# EAGLE schematic LSM9DS0 (EAGLE 7.1.0)
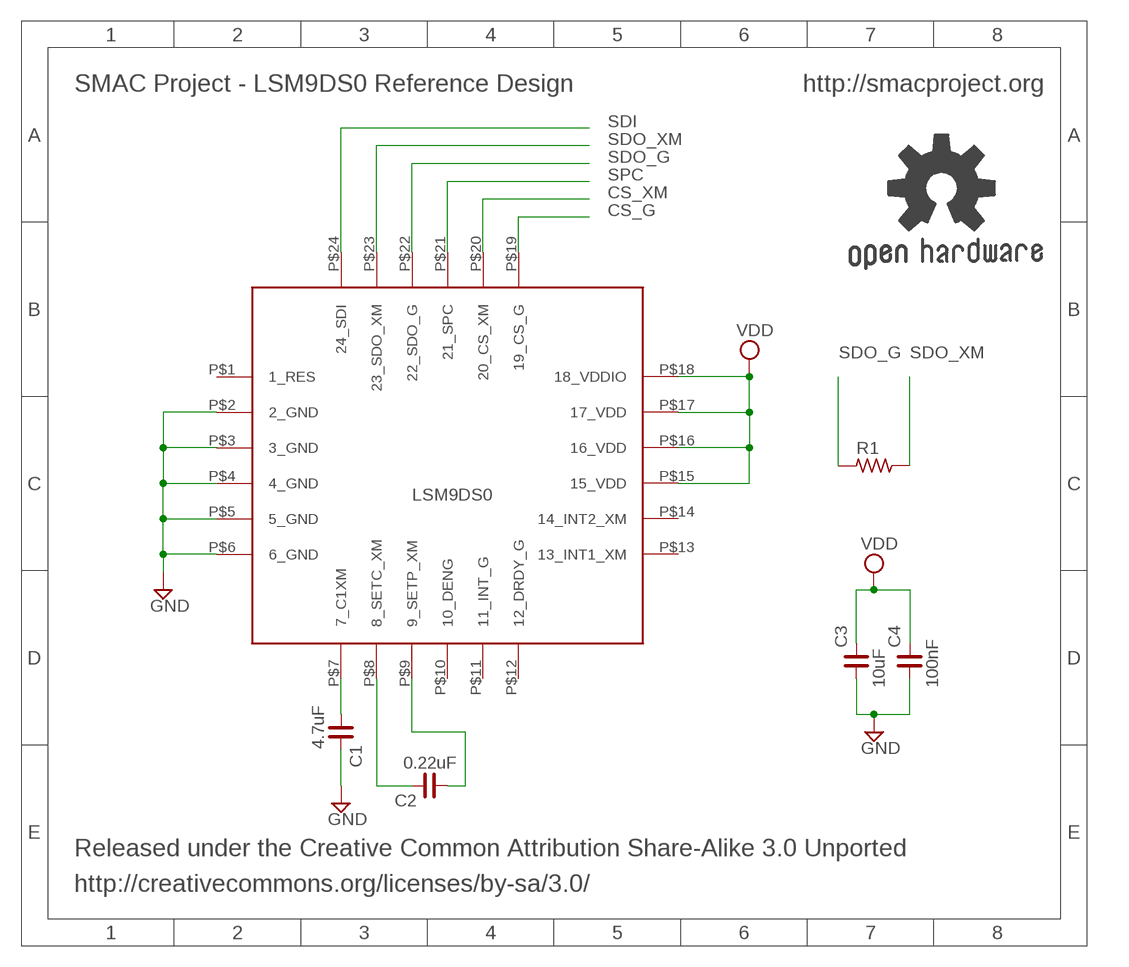
[diagram p0: schematic, sheet 1]

## Parts
C1  4.7uF  C_0402  [C0402]
C2  0.22uF  C_0402  [C0402]
C3  10uF  C_0402  [C0402]
C4  100nF  C_0402  [C0402]
GOLD_ORB_SM2  OSHWLOGO_REF_SM  [OSHW2REF]
R1  R_0402  [R0402]
U$1  LSM9DS09DOFS0  [LGA24(4X4X1)]

## Nets
CS_G: U$1.P$19(19_CS_G)
CS_XM: U$1.P$20(20_CS_XM)
GND: C1.2 C3.1 C4.1 U$1.P$2(2_GND) U$1.P$3(3_GND) U$1.P$4(4_GND) U$1.P$5(5_GND) U$1.P$6(6_GND)
N$1: C1.1 U$1.P$7(7_C1XM)
N$2: C2.2 U$1.P$8(8_SETC_XM)
N$3: C2.1 U$1.P$9(9_SETP_XM)
SDI: U$1.P$24(24_SDI)
SDO_G: R1.1 U$1.P$22(22_SDO_G)
SDO_XM: R1.2 U$1.P$23(23_SDO_XM)
SPC: U$1.P$21(21_SPC)
VDD: C3.2 C4.2 U$1.P$15(15_VDD) U$1.P$16(16_VDD) U$1.P$17(17_VDD) U$1.P$18(18_VDDIO)
Unconnected: U$1.P$1(1_RES) U$1.P$10(10_DENG) U$1.P$11(11_INT_G) U$1.P$12(12_DRDY_G) U$1.P$13(13_INT1_XM) U$1.P$14(14_INT2_XM)

## Notes on the sheet
- SMAC Project - LSM9DS0 Reference Design | http://smacproject.org
- Released under the Creative Common Attribution Share-Alike 3.0 Unported
- http://creativecommons.org/licenses/by-sa/3.0/

## Library data of the parts
C1-C4 = rc-master-smd:C_: NON-POLARIZED CAP
GOLD_ORB_SM2 = bfl:OSHWLOGO: These are Open-Source Hardware logos.
R1 = rc-master-smd:R_: RESISTOR
U$1 = lsm9ds0:LSM9DS0